# EAGLE schematic EEG_interface_@ (EAGLE 6.1)
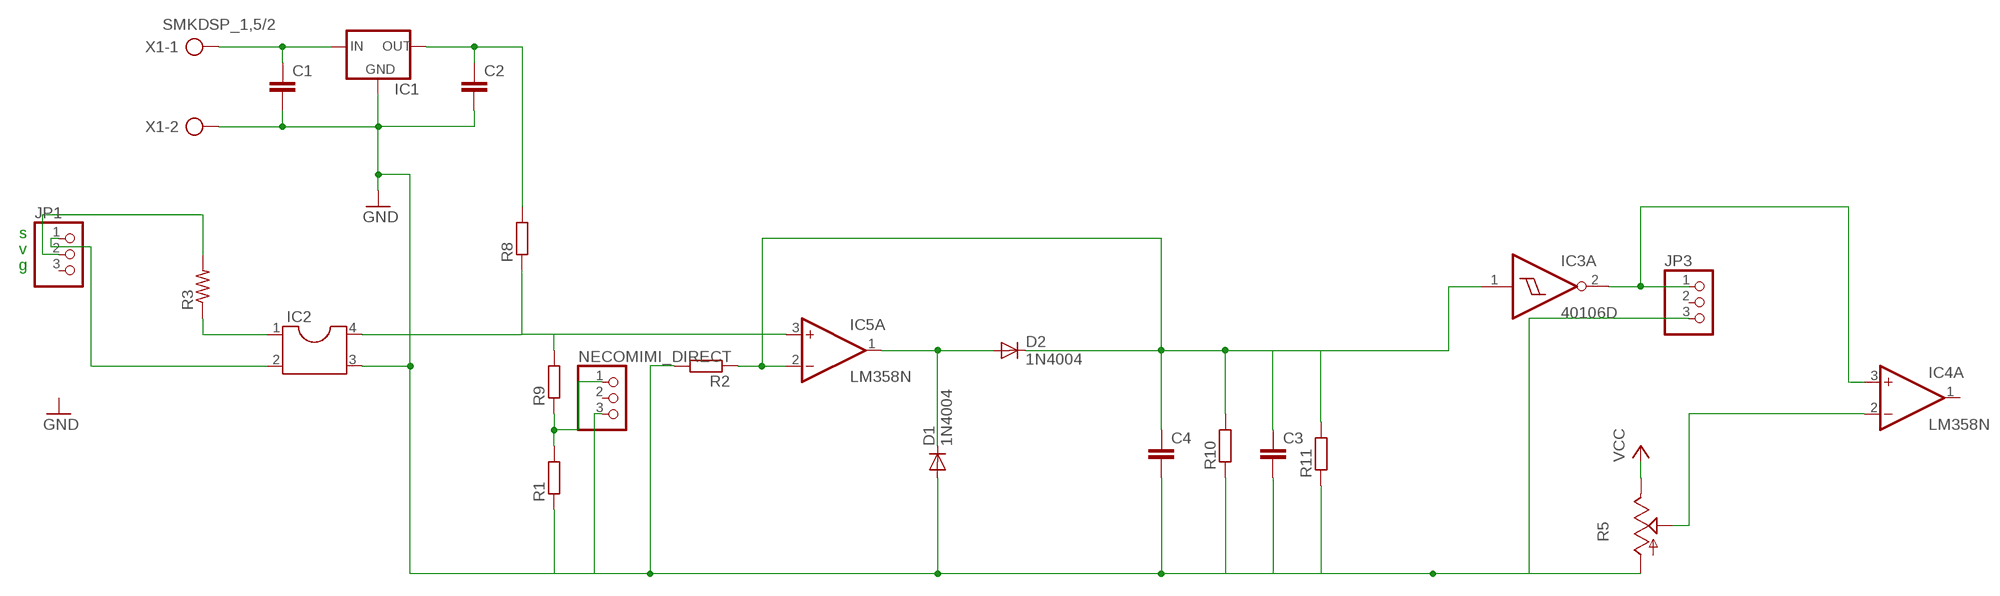
[diagram p0: schematic, sheet 1]

## Parts
C1  C2,5-3  [C2.5-3]
C2  C2,5-3  [C2.5-3]
C3  C2,5-3  [C2.5-3]
C4  C2,5-3  [C2.5-3]
D1  1N4004  [DO41-10]
D2  1N4004  [DO41-10]
IC1  78XXS  [78XXS]
IC2  DIL4  [DIL04]
IC3  40106D  [SO14]
IC4  LM358N  [DIL08]
IC5  LM358N  [DIL08]
JP1  PINHD-1X3  [1X03]
JP3  PINHD-1X3  [1X03]
NECOMIMI_DIRECT  PINHD-1X3  [1X03]
R1  R-EU_0207/12  [0207/12]
R2  R-EU_0207/12  [0207/12]
R3  R-US_0204/2V  [0204V]
R5  TRIM_US-3223G  [3223G]
R8  R-EU_0207/12  [0207/12]
R9  R-EU_0207/12  [0207/12]
R10  R-EU_0207/12  [0207/12]
R11  R-EU_0207/12  [0207/12]
X1  SMKDSP_1,5/2  [SMKDSP_1,5/2]

## Nets
GND: C1.2 C2.2 C3.2 C4.2 D1.A IC1.GND IC2.3 JP3.3 NECOMIMI_DIRECT.3 R1.1 R2.2 R5.1(A) R10.1 R11.1 X1.2
N$1: C1.1 IC1.IN X1.1
N$2: C2.1 IC1.OUT R8.2
N$3: NECOMIMI_DIRECT.1 R1.2 R9.1
N$4: IC2.4 IC5.3(A:+IN) R8.1 R9.2
N$5: JP1.2 R3.2
N$7: IC2.1 R3.1
N$8: IC3.2(A:O) IC4.3(A:+IN) JP3.1
N$9: IC2.2 JP1.1
N$10: IC4.2(A:-IN) R5.2(S)
N$11: C3.1 C4.1 D2.C IC3.1(A:I) IC5.2(A:-IN) R2.1 R10.2 R11.2
N$12: D1.C D2.A IC5.1(A:OUT)
VCC: R5.3(E)
Unconnected: IC3.3(B:I) IC3.4(B:O) IC3.5(C:I) IC3.6(C:O) IC3.8(D:O) IC3.9(D:I) IC3.10(E:O) IC3.11(E:I) IC3.12(F:O) IC3.13(F:I) IC4.1(A:OUT) IC4.5(B:+IN) IC4.6(B:-IN) IC4.7(B:OUT) IC5.5(B:+IN) IC5.6(B:-IN) IC5.7(B:OUT) JP1.3 JP3.2 NECOMIMI_DIRECT.2

## Notes on the sheet
- s
- v
- g

## Power pins joined to a net without a drawn wire
V+: IC4.8(P:V+) IC5.8(P:V+)
V-: IC4.4(P:V-) IC5.4(P:V-)
VDD: IC3.14(P:VDD)
VSS: IC3.7(P:VSS)

## Library data of the parts
C1-C4 = capacitor-wima:C: CAPACITOR naming: grid - package width
D1 D2 = diode:1N4004: DIODE general purpose rectifier, 1 A
IC1 = v-reg:78XXS: VOLTAGE REGULATOR
IC2 = ic-package:DIL4: Dual In Line / Socket
IC3 = 40xx:40106: Hex SCHMITT TRIGGER
IC4 IC5 = linear:LM358: OP AMP also LM158; LM258; LM2904 Source: http://cache.national.com/ds/LM/LM158.pdf
JP1 JP3 NECOMIMI_DIRECT = pinhead:PINHD-1X3: PIN HEADER
R1 R2 R8-R11 = rcl:R-EU_: RESISTOR, European symbol
R3 = resistor:R-US_: RESISTOR, American symbol
R5 = pot:TRIM_US-: POTENTIOMETER
X1 = con-phoenix-smkdsp:SMKDSP_1,5/2: Printklemme, Nennstrom: 17,5 A, Bemessungsspannung: 250 V, Raster: 5,0 mm Source: http://eshop.phoenixcontact.de .. 1733415.pdf; MF: FARNELL; MPN: 1733570; OC_FARNELL: 3041244; OC_NEWARK: 69C8588